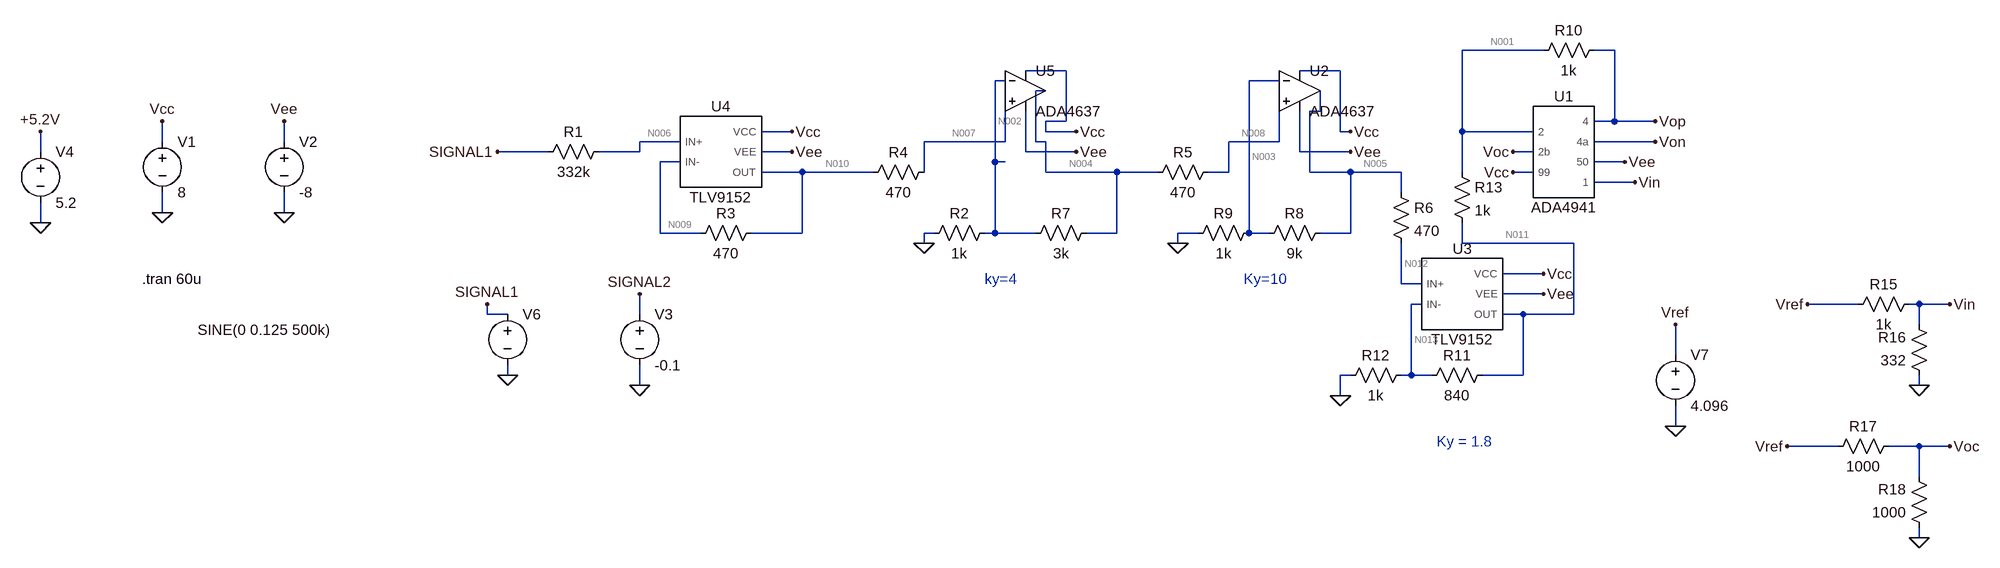
[diagram p0: schematic Тракт.asc]
Тракт.asc, the LTspice schematic file:
Version 4.1
SHEET 1 1368 852
WIRE 144 64 16 64
WIRE 256 64 224 64
WIRE -608 96 -672 96
WIRE -176 96 -240 96
WIRE -704 112 -720 112
WIRE -272 112 -320 112
WIRE -640 128 -656 128
WIRE -208 160 -208 128
WIRE -208 160 -224 160
WIRE -608 176 -608 96
WIRE -608 176 -640 176
WIRE 256 176 256 64
WIRE 256 176 224 176
WIRE 320 176 256 176
WIRE -1040 192 -1088 192
WIRE -640 192 -640 176
WIRE -592 192 -640 192
WIRE -176 192 -176 96
WIRE -160 192 -176 192
WIRE 16 192 16 64
WIRE 128 192 16 192
WIRE -2032 208 -2032 176
WIRE -1840 208 -1840 176
WIRE -1216 208 -1280 208
WIRE -704 208 -704 144
WIRE -704 208 -832 208
WIRE -656 208 -656 128
WIRE -640 208 -656 208
WIRE -272 208 -272 144
WIRE -272 208 -352 208
WIRE 320 208 224 208
WIRE -2224 224 -2224 192
WIRE -1424 224 -1504 224
WIRE -1280 224 -1280 208
WIRE -1280 224 -1344 224
WIRE -1040 224 -1088 224
WIRE -672 224 -672 160
WIRE -592 224 -672 224
WIRE -240 224 -240 160
WIRE -160 224 -240 224
WIRE 128 224 96 224
WIRE -1216 240 -1248 240
WIRE -720 240 -720 112
WIRE -704 240 -720 240
WIRE 272 240 224 240
WIRE -1024 256 -1088 256
WIRE -912 256 -1024 256
WIRE -832 256 -832 208
WIRE -640 256 -640 208
WIRE -528 256 -640 256
WIRE -464 256 -528 256
WIRE -352 256 -352 208
WIRE -352 256 -384 256
WIRE -224 256 -224 160
WIRE -160 256 -224 256
WIRE -80 256 -160 256
WIRE 16 256 16 192
WIRE 128 256 96 256
WIRE 288 272 224 272
WIRE -80 288 -80 256
WIRE -2032 320 -2032 288
WIRE -1840 320 -1840 288
WIRE -2224 336 -2224 304
WIRE -1248 352 -1248 240
WIRE -1184 352 -1248 352
WIRE -1024 352 -1024 256
WIRE -1024 352 -1104 352
WIRE -816 352 -832 352
WIRE -720 352 -720 240
WIRE -720 352 -736 352
WIRE -656 352 -720 352
WIRE -528 352 -528 256
WIRE -528 352 -576 352
WIRE -400 352 -432 352
WIRE -320 352 -320 112
WIRE -288 352 -320 352
WIRE -160 352 -160 256
WIRE -160 352 -208 352
WIRE -832 368 -832 352
WIRE -432 368 -432 352
WIRE 16 368 16 336
WIRE 192 368 16 368
WIRE 144 416 80 416
WIRE -80 432 -80 368
WIRE -48 432 -80 432
WIRE 144 448 80 448
WIRE -48 464 -64 464
WIRE 640 464 560 464
WIRE 736 464 720 464
WIRE 784 464 736 464
WIRE -1520 480 -1520 464
WIRE -1488 480 -1520 480
WIRE -1280 480 -1280 448
WIRE 112 480 80 480
WIRE 192 480 192 368
WIRE 192 480 112 480
WIRE 736 496 736 464
WIRE 352 544 352 496
WIRE -1488 576 -1488 560
WIRE -160 576 -176 576
WIRE -64 576 -64 464
WIRE -64 576 -80 576
WIRE -32 576 -64 576
WIRE 112 576 112 480
WIRE 112 576 48 576
WIRE -1280 592 -1280 560
WIRE 736 592 736 576
WIRE -176 608 -176 576
WIRE 352 656 352 624
WIRE 608 688 528 688
WIRE 736 688 688 688
WIRE 784 688 736 688
WIRE 736 736 736 688
WIRE 736 832 736 816
FLAG -1840 320 0
FLAG -2032 320 0
FLAG -2032 176 Vcc
FLAG -1040 192 Vcc
FLAG -592 192 Vcc
FLAG -160 192 Vcc
FLAG 96 256 Vcc
FLAG -1840 176 Vee
FLAG -1040 224 Vee
FLAG -592 224 Vee
FLAG -160 224 Vee
FLAG 272 240 Vee
FLAG -832 368 0
FLAG -432 368 0
FLAG 320 208 Von
FLAG 320 176 Vop
FLAG -1488 576 0
FLAG -1520 464 SIGNAL1
FLAG -1280 592 0
FLAG -1280 448 SIGNAL2
FLAG -1504 224 SIGNAL1
FLAG -176 608 0
FLAG 144 416 Vcc
FLAG 144 448 Vee
FLAG 352 656 0
FLAG 352 496 Vref
FLAG 560 464 Vref
FLAG 736 592 0
FLAG 784 464 Vin
FLAG 288 272 Vin
FLAG 528 688 Vref
FLAG 736 832 0
FLAG 784 688 Voc
FLAG 96 224 Voc
FLAG -2224 192 +5.2V
FLAG -2224 336 0
DATAFLAG 768 688 ""
DATAFLAG 768 464 ""
DATAFLAG 272 208 ""
DATAFLAG 288 176 ""
DATAFLAG -128 256 ""
SYMBOL ADA4941 176 224 R0
SYMATTR InstName U1
SYMBOL TLV9152 -1152 224 R0
SYMATTR InstName U4
SYMBOL res -1328 208 R90
WINDOW 0 0 56 VBottom 2
WINDOW 3 32 56 VTop 2
SYMATTR InstName R1
SYMATTR Value 332k
SYMBOL voltage -2032 192 R0
WINDOW 123 0 0 Left 0
WINDOW 39 0 0 Left 0
SYMATTR InstName V1
SYMATTR Value 8
SYMBOL voltage -1840 192 R0
WINDOW 123 0 0 Left 0
WINDOW 39 0 0 Left 0
SYMATTR InstName V2
SYMATTR Value -8
SYMBOL voltage -1280 464 R0
WINDOW 123 0 0 Left 0
WINDOW 39 0 0 Left 0
SYMATTR InstName V3
SYMATTR Value -0.1
SYMBOL res -1088 336 R90
WINDOW 0 0 56 VBottom 2
WINDOW 3 32 56 VTop 2
SYMATTR InstName R3
SYMATTR Value 470
SYMBOL res -816 240 R90
WINDOW 0 0 56 VBottom 2
WINDOW 3 32 56 VTop 2
SYMATTR InstName R4
SYMATTR Value 470
SYMBOL res -368 240 R90
WINDOW 0 0 56 VBottom 2
WINDOW 3 32 56 VTop 2
SYMATTR InstName R5
SYMATTR Value 470
SYMBOL res -720 336 R90
WINDOW 0 0 56 VBottom 2
WINDOW 3 32 56 VTop 2
SYMATTR InstName R2
SYMATTR Value 1k
SYMBOL res -560 336 R90
WINDOW 0 0 56 VBottom 2
WINDOW 3 32 56 VTop 2
SYMATTR InstName R7
SYMATTR Value 3k
SYMBOL res -192 336 R90
WINDOW 0 0 56 VBottom 2
WINDOW 3 32 56 VTop 2
SYMATTR InstName R8
SYMATTR Value 9k
SYMBOL res -304 336 R90
WINDOW 0 0 56 VBottom 2
WINDOW 3 32 56 VTop 2
SYMATTR InstName R9
SYMATTR Value 1k
SYMBOL res 240 48 R90
WINDOW 0 0 56 VBottom 2
WINDOW 3 32 56 VTop 2
SYMATTR InstName R10
SYMATTR Value 1k
SYMBOL voltage -1488 464 R0
WINDOW 3 -488 40 Left 2
WINDOW 123 0 0 Left 0
WINDOW 39 0 0 Left 0
SYMATTR Value SINE(0 0.125 500k)
SYMATTR InstName V6
SYMBOL OpAmps\\ADA4637 -672 64 R0
SYMATTR InstName U5
SYMBOL OpAmps\\ADA4637 -240 64 R0
SYMATTR InstName U2
SYMBOL TLV9152 16 448 R0
SYMATTR InstName U3
SYMBOL res 64 560 R90
WINDOW 0 0 56 VBottom 2
WINDOW 3 32 56 VTop 2
SYMATTR InstName R11
SYMATTR Value 840
SYMBOL res -64 560 R90
WINDOW 0 0 56 VBottom 2
WINDOW 3 32 56 VTop 2
SYMATTR InstName R12
SYMATTR Value 1k
SYMBOL res -96 272 R0
SYMATTR InstName R6
SYMATTR Value 470
SYMBOL res 0 240 R0
SYMATTR InstName R13
SYMATTR Value 1k
SYMBOL voltage 352 528 R0
WINDOW 123 0 0 Left 0
WINDOW 39 0 0 Left 0
SYMATTR InstName V7
SYMATTR Value 4.096
SYMBOL res 736 448 R90
WINDOW 0 0 56 VBottom 2
WINDOW 3 32 56 VTop 2
SYMATTR InstName R15
SYMATTR Value 1k
SYMBOL res 752 592 R180
WINDOW 0 36 76 Left 2
WINDOW 3 36 40 Left 2
SYMATTR InstName R16
SYMATTR Value 332
SYMBOL res 704 672 R90
WINDOW 0 0 56 VBottom 2
WINDOW 3 32 56 VTop 2
SYMATTR InstName R17
SYMATTR Value 1000
SYMBOL res 752 832 R180
WINDOW 0 36 76 Left 2
WINDOW 3 36 40 Left 2
SYMATTR InstName R18
SYMATTR Value 1000
SYMBOL voltage -2224 208 R0
WINDOW 123 0 0 Left 0
WINDOW 39 0 0 Left 0
SYMATTR InstName V4
SYMATTR Value 5.2
TEXT -2064 424 Left 2 !.tran 60u
TEXT -736 424 Left 2 ;ky=4
TEXT -328 424 Left 2 ;Ky=10
TEXT -24 680 Left 2 ;Ky = 1.8

The netlist it stands for:
* Тракт.asc
X§U1 N001 Voc Vcc Vop Von Vee Vin ADA4941  ; pins 2 2b 99 4 4a 50 1
X§U4 N006 N009 Vcc Vee N010 TLV9152  ; pins IN+ IN- VCC VEE OUT
R1 N006 SIGNAL1 332k
V1 Vcc 0 8
V2 Vee 0 -8
V3 SIGNAL2 0 -0.1
R3 N010 N009 470
R4 N007 N010 470
R5 N008 N004 470
R2 N002 0 1k
R7 N004 N002 3k
R8 N005 N003 9k
R9 N003 0 1k
R10 Vop N001 1k
V6 SIGNAL1 0 SINE(0 0.125 500k)
X§U5 N007 N002 Vcc Vee N004 ADA4637  ; pins In+ In- V+ V- OUT
X§U2 N008 N003 Vcc Vee N005 ADA4637  ; pins In+ In- V+ V- OUT
X§U3 N012 N013 Vcc Vee N011 TLV9152  ; pins IN+ IN- VCC VEE OUT
R11 N011 N013 840
R12 N013 0 1k
R6 N005 N012 470
R13 N001 N011 1k
V7 Vref 0 4.096
R15 Vin Vref 1k
R16 0 Vin 332
R17 Voc Vref 1000
R18 0 Voc 1000
V4 +5.2V 0 5.2
.tran 60u
* ky=4
* Ky=10
* Ky = 1.8
.lib ada4941.cir
.lib tlv9152.lib
.backanno
.end

* Results of the author's LTspice run, read from the files saved beside the schematic
* Operating Point, zero values left out:
*   V(voc) = 2.046 V
*   V(vop) = 2.044 V
*   V(von) = 2.049 V
*   V(vin) = 1.02 V
*   V(n010) = 122.2 µV
*   V(signal2) = -100 mV
*   V(n007) = 122.2 µV
*   V(n004) = 70.66 µV
*   V(n003) = -33.84 µV
*   V(n013) = -213.5 µV
*   V(+5.2v) = 5.2 V
*   V(n001) = 1.02 V
*   V(vcc) = 8 V
*   V(vee) = -8 V
*   V(n006) = -3.32 µV
*   V(n009) = 122.2 µV
*   V(n008) = 70.63 µV
*   V(n002) = 17.72 µV
*   V(n005) = -339.1 µV
*   V(n012) = -339.1 µV
*   V(n011) = -392.8 µV
*   V(vref) = 4.096 V
*   I(R4) = -57.63 pA
*   I(R7) = 17.64 nA
*   I(R9) = -33.84 nA
*   I(R10) = 1.023 mA
*   I(R11) = -213.5 nA
*   I(R13) = 1.021 mA
*   I(R15) = -3.076 mA
*   I(R1) = -10 pA
*   I(V2) = 17.7 mA
*   I(R16) = -3.073 mA
*   I(R18) = -2.046 mA
*   I(V1) = -18.74 mA
*   I(R5) = -57.72 pA
*   I(R2) = 17.72 nA
*   I(R8) = -33.92 nA
*   I(R12) = -213.5 nA
*   I(R6) = 9.822 pA
*   I(V7) = -5.125 mA
*   I(V6) = -10 pA
*   I(R17) = -2.05 mA
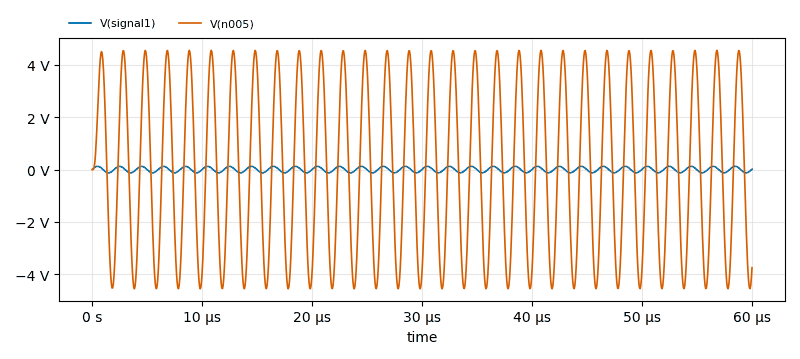
[diagram p1: Transient Analysis of Тракт.asc, plotted from the saved traces]
* Transient Analysis, 1 run:
*   V(signal1): min -125 mV, max 125 mV, average 7.029 µV, rms 88.41 mV, last 14.03 mV
*   V(n005): min -4.559 V, max 4.559 V, average 12.5 mV, rms 3.215 V, last -3.752 V